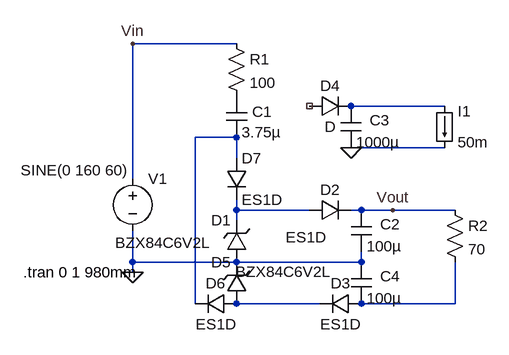
[diagram p0: schematic doubler.asc]
doubler.asc, the LTspice schematic file:
Version 4
SHEET 1 880 680
WIRE 160 -96 0 -96
WIRE 480 0 336 0
WIRE 160 48 96 48
WIRE 480 64 336 64
WIRE 160 80 160 48
WIRE 0 112 0 -96
WIRE 160 160 160 144
WIRE 272 160 160 160
WIRE 352 160 336 160
WIRE 400 160 352 160
WIRE 496 160 400 160
WIRE 160 176 160 160
WIRE 0 240 0 192
WIRE 160 240 0 240
WIRE 352 240 352 224
WIRE 352 240 160 240
WIRE 0 256 0 240
WIRE 96 304 96 48
WIRE 288 304 160 304
WIRE 496 304 496 240
WIRE 496 304 352 304
FLAG 0 256 0
FLAG 400 160 Vout
FLAG 0 -96 Vin
FLAG 336 64 0
SYMBOL res 144 -112 R0
SYMATTR InstName R1
SYMATTR Value 100
SYMBOL cap 144 -16 R0
WINDOW 0 40 25 Left 2
SYMATTR InstName C1
SYMATTR Value 3.75µ
SYMBOL zener 176 240 R180
WINDOW 0 24 64 Left 2
WINDOW 3 56 30 Left 2
SYMATTR InstName D1
SYMATTR Value BZX84C6V2L
SYMBOL cap 336 160 R0
WINDOW 0 45 22 Left 2
SYMATTR InstName C2
SYMATTR Value 100µ
SYMBOL voltage 0 96 R0
WINDOW 3 -172 3 Left 2
WINDOW 123 0 0 Left 2
WINDOW 39 0 0 Left 2
SYMATTR Value SINE(0 160 60)
SYMATTR InstName V1
SYMBOL res 480 144 R0
SYMATTR InstName R2
SYMATTR Value 70
SYMBOL diode 272 176 R270
WINDOW 0 32 32 VTop 2
WINDOW 3 -10 -5 VBottom 2
SYMATTR InstName D2
SYMATTR Value ES1D
SYMBOL diode 272 16 R270
WINDOW 0 32 32 VTop 2
WINDOW 3 0 32 VBottom 2
SYMATTR InstName D4
SYMBOL cap 320 0 R0
WINDOW 0 45 22 Left 2
SYMATTR InstName C3
SYMATTR Value 1000µ
SYMBOL load 464 0 R0
WINDOW 123 0 0 Left 2
WINDOW 39 0 0 Left 2
SYMATTR InstName I1
SYMATTR Value 50m
SYMBOL cap 336 240 R0
WINDOW 0 45 22 Left 2
SYMATTR InstName C4
SYMATTR Value 100µ
SYMBOL diode 352 288 R90
WINDOW 0 0 32 VBottom 2
WINDOW 3 32 32 VTop 2
SYMATTR InstName D3
SYMATTR Value ES1D
SYMBOL zener 176 304 R180
WINDOW 0 24 64 Left 2
WINDOW 3 -130 49 Left 2
SYMATTR InstName D5
SYMATTR Value BZX84C6V2L
SYMBOL diode 160 288 R90
WINDOW 0 0 32 VBottom 2
WINDOW 3 32 32 VTop 2
SYMATTR InstName D6
SYMATTR Value ES1D
SYMBOL diode 144 80 R0
SYMATTR InstName D7
SYMATTR Value ES1D
TEXT -168 256 Left 2 !.tran 0 1 980mm

The netlist it stands for:
* doubler.asc
R1 Vin P001 100
C1 P001 N002 3.75µ
D1 0 N003 BZX84C6V2L
C2 Vout 0 100µ
V1 Vin 0 SINE(0 160 60)
R2 Vout N005 70
D2 N003 Vout ES1D
D4 NC_01 N001 D
C3 N001 0 1000µ
I1 N001 0 50m
C4 0 N005 100µ
D3 N005 N004 ES1D
D5 N004 0 BZX84C6V2L
D6 N004 N002 ES1D
D7 N002 N003 ES1D
.model D D
.lib standard.dio
.tran 0 1 980mm
.backanno
.end